# EAGLE design sulamatikV3 (EAGLE 6.4)
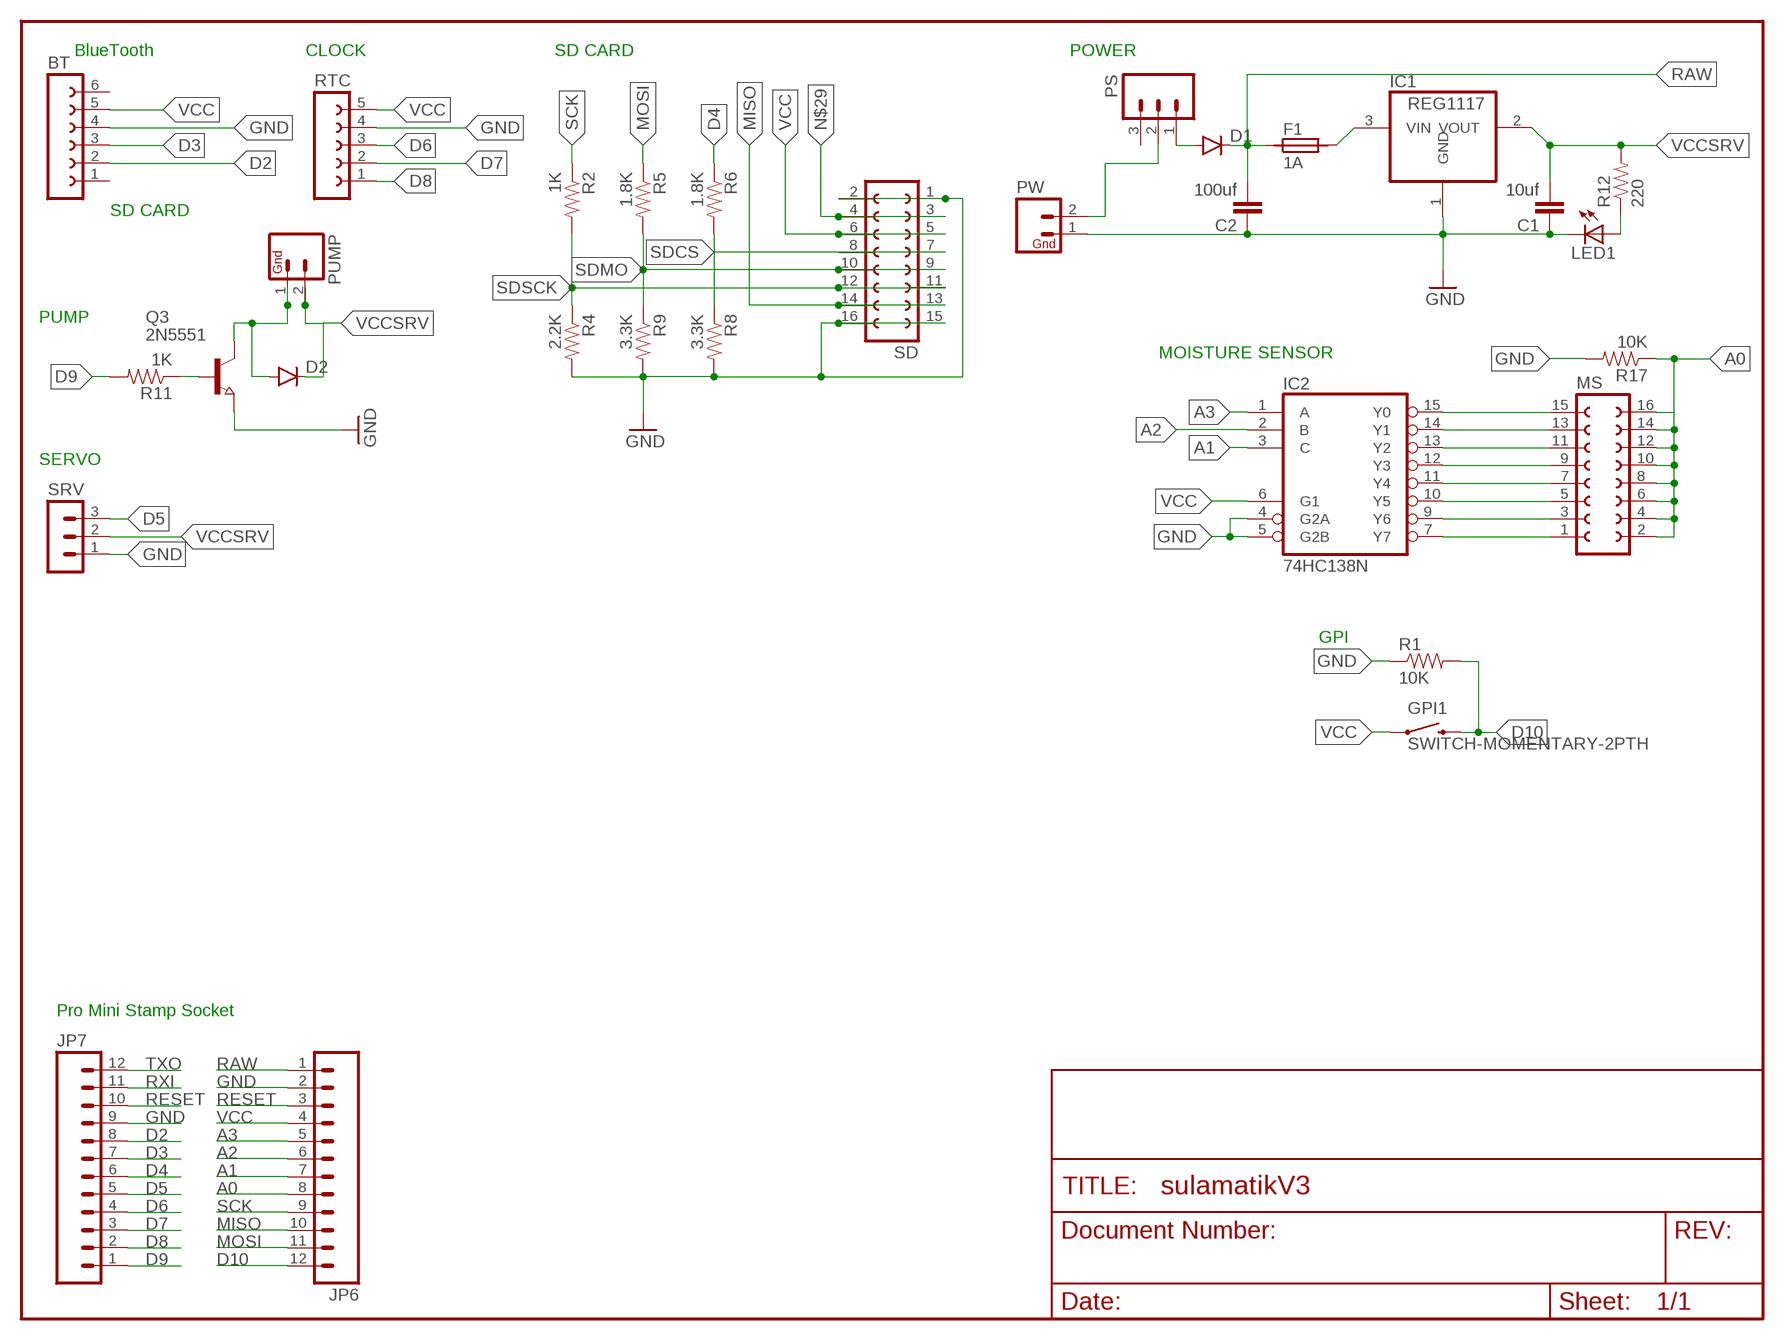
[diagram p0: schematic, sheet 1]

## Parts
BT  FE06-1  [FE06]
C1  10uf  CAP0805  [0805]
C2  100uf  CAP0805  [0805]
D1  DIODESMA  [SMA-DIODE]
D2  DIODESMA  [SMA-DIODE]
F1  1A  SIBA194600  [1820]
GPI1  SWITCH-MOMENTARY-2PTH  [TACTILE-PTH]
IC1  REG1117  [SOT223]
IC2  74HC138N  [DIL16]
JP6  M12PTH  [1X12]
JP7  M12PTH  [1X12]
LED1  LEDCHIP-LED0805  [CHIP-LED0805]
MS  FE08-2  [FE08-2]
PS  M03PTH  [1X03]
PUMP  M02PTH  [1X02]
PW  M02PTH  [1X02]
Q3  2N5551  NPN-TRANSISTOR_SOT23  [SOT23]
R1  10K  RESISTOR0805-RES  [0805]
R2  1K  RESISTOR0805-RES  [0805]
R4  2.2K  RESISTOR0805-RES  [0805]
R5  1.8K  RESISTOR0805-RES  [0805]
R6  1.8K  RESISTOR0805-RES  [0805]
R8  3.3K  RESISTOR0805-RES  [0805]
R9  3.3K  RESISTOR0805-RES  [0805]
R11  1K  RESISTOR0805-RES  [0805]
R12  220  RESISTOR0805-RES  [0805]
R17  10K  RESISTOR0805-RES  [0805]
RTC  FE05-1  [FE05-1]
SD  FE08-2  [FE08-2]
SRV  MA03-1  [MA03-1]

## Nets
A0: JP6.8 MS.2 MS.4 MS.6 MS.8 MS.10 MS.12 MS.14 MS.16 R17.1
A1: IC2.3(C) JP6.7
A2: IC2.2(B) JP6.6
A3: IC2.1(A) JP6.5
D2: BT.2 JP7.8
D3: BT.3 JP7.7
D4: JP7.6 R6.1
D5: JP7.5 SRV.3
D6: JP7.4 RTC.3
D7: JP7.3 RTC.2
D8: JP7.2 RTC.1
D9: JP7.1 R11.2
D10: GPI1.3 JP6.12 R1.2
GND: BT.4 C1.1 C2.1 IC1.1(GND) IC2.4(G2A) IC2.5(G2B) JP6.2 JP7.9 LED1.C PW.1 Q3.2(E) R1.1 R4.2 R8.2 R9.2 R17.2 RTC.4 SD.1 SD.2 SD.15 SD.16 SRV.1
MISO: JP6.10 SD.13 SD.14
MOSI: JP6.11 R5.1
N$1: F1.2 IC1.3(VIN)
N$2: PS.2 PW.2
N$3: IC2.15(Y0) MS.15
N$5: D2.A PUMP.1 Q3.3(C)
N$6: Q3.1(B) R11.1
N$7: IC2.14(Y1) MS.13
N$8: IC2.13(Y2) MS.11
N$10: IC2.12(Y3) MS.9
N$11: LED1.A R12.1
N$12: IC2.11(Y4) MS.7
N$13: D1.A PS.1
N$14: IC2.10(Y5) MS.5
N$15: IC2.9(Y6) MS.3
N$16: IC2.7(Y7) MS.1
N$29: SD.3 SD.4
RAW [v]: C2.2 D1.C F1.1 JP6.1
RESET: JP6.3 JP7.10
RXI: JP7.11
SCK: JP6.9 R2.1
SDCS: R6.2 R8.1 SD.7 SD.8
SDMO: R5.2 R9.1 SD.9 SD.10
SDSCK: R2.2 R4.1 SD.11 SD.12
TXO: JP7.12
VCC: BT.5 GPI1.1 IC2.6(G1) JP6.4 RTC.5 SD.5 SD.6
VCCSRV: C1.2 D2.C IC1.2(VOUT) PUMP.2 R12.2 SRV.2
Unconnected: BT.1 BT.6 PS.3

## Notes on the sheet
- BlueTooth | CLOCK | SD CARD | POWER
- SD CARD
- PUMP
- MOISTURE SENSOR
- SERVO
- GPI
- Pro Mini Stamp Socket

## Power pins joined to a net without a drawn wire
GND: IC2.8(GND)
VCC: IC2.16(VCC)

## Library data of the parts
BT = con-lsta:FE06-1: FEMALE HEADER; OC_FARNELL: unknown; OC_NEWARK: unknown
C1 C2 = SparkFun-Capacitors:CAP: Capacitor Standard 0603 ceramic capacitor, and 0.1" leaded capacitor.
D1 D2 = SparkFun-DiscreteSemi:DIODE: Diode These are standard reverse protection diodes and small signal diodes. SMA package can handle up to about 1A. SOD-323 can handle about 200mA. What the SOD-323 package when ordering, there are some mfgs out there that are 5-pin packages.
F1 = _hhn_PtcFuses_Siba_r500_Ozan:SIBA194600*: SIBA PTC-Fuses, Series 194600, 1812 (4.5 3.2)mm Source: www.siba.de/ Package: SMD 1812 (4.5 x 3.2)mm Technologies: SIBA194600Axxx xxx: Trip-Current * 10 mA Author: Dipl.-Ing. FH Rainer Bayer
GPI1 = SparkFun-Electromechanical:SWITCH-MOMENTARY-2: Various NO switches- pushbuttons, reed, etc
IC1 = burr-brown:REG1117: 800mA and 1A Low Dropout (LDO) Positive Regulator 1.8V, 2.5V, 2.85V, 3.3V, 5V, and Adj; MPN: REG1117; OC_FARNELL: 1097566; OC_NEWARK: 14P6981
IC2 = 74xx-eu:74*138: 3-line to 8-line DECODER/DEMULTIPLEXER
JP6 JP7 = SparkFun:M12: Header 12 Standard 12-pin 0.1" header. Use with straight break away headers (SKU : PRT-00116), right angle break away headers (PRT-00553), swiss pins (PRT-00743), machine pins (PRT-00117), and female headers (PRT-00115).
LED1 = led:LED: LED OSRAM: - CHIPLED LG R971, LG N971, LY N971, LG Q971, LY Q971, LO R971, LY R971 LH N974, LH R974 LS Q976, LO Q976, LY Q976 LO Q996 - Hyper CHIPLED LW Q18S LB Q993, LB Q99A, LB R99A - SideLED LS A670, LO A670, LY A670, LG A670, LP A670 LB A673, LV A673, LT A673, LW A673 LH A674 LY A675 LS A676, LA A676, LO A676, LY A676, LW A676 LS A679, LY A679, LG A679 - Hyper Micro SIDELED® LS Y876, LA Y876, LO Y876, LY Y876 LT Y87S - SmartLED LW L88C, LW L88S LB L89C, LB L89S, LG L890 LS L89K, LO L89K, LY L89K LS L896, LA L896, LO L896, LY L896 - TOPLED LS T670, LO T670, LY T670, LG T670, LP T670 LSG T670, LSP T670, LSY T670, LOP T670, LYG T670 LG T671, LOG T671, LSG T671 LB T673, LV T673, LT T673, LW T673 LH T674 LS T676, LA T676, LO T676, LY T676, LB T676, LH T676, LSB T676, LW T676 LB T67C, LV T67C, LT T67C, LS T67K, LO T67K, LY T67K, LW E67C LS E67B, LA E67B, LO E67B, LY E67B, LB E67C, LV E67C, LT E67C LW T67C LS T679, LY T679, LG T679 LS T770, LO T770, LY T770, LG T770, LP T770 LB T773, LV T773, LT T773, LW T773 LH T774 LS E675, LA E675, LY E675, LS T675 LS T776, LA T776, LO T776, LY T776, LB T776 LHGB T686 LT T68C, LB T68C - Hyper Mini TOPLED® LB M676 - Mini TOPLED Santana® LG M470 LS M47K, LO M47K, LY M47K Source: http://www.osram.convergy.de LUXEON: - LUMILED® LXK2-PW12-R00, LXK2-PW12-S00, LXK2-PW14-U00, LXK2-PW14-V00 LXK2-PM12-R00, LXK2-PM12-S00, LXK2-PM14-U00 LXK2-PE12-Q00, LXK2-PE12-R00, LXK2-PE12-S00, LXK2-PE14-T00, LXK2-PE14-U00 LXK2-PB12-K00, LXK2-PB12-L00, LXK2-PB12-M00, LXK2-PB14-N00, LXK2-PB14-P00, LXK2-PB14-Q00 LXK2-PR12-L00, LXK2-PR12-M00, LXK2-PR14-Q00, LXK2-PR14-R00 LXK2-PD12-Q00, LXK2-PD12-R00, LXK2-PD12-S00 LXK2-PH12-R00, LXK2-PH12-S00 LXK2-PL12-P00, LXK2-PL12-Q00, LXK2-PL12-R00 Source: www.luxeon.com KINGBRIGHT: KA-3528ASYC Source: www.kingbright.com
MS SD = con-lsta:FE08-2: FEMALE HEADER; OC_FARNELL: unknown; OC_NEWARK: unknown
PS = SparkFun-Connectors:M03: Header 3 Standard 3-pin 0.1" header. Use with straight break away headers (SKU : PRT-00116), right angle break away headers (PRT-00553), swiss pins (PRT-00743), machine pins (PRT-00117), and female headers (PRT-00115). Molex polarized connector foot print use with SKU : PRT-08232 with associated crimp pins and housings.
PUMP PW = SparkFun:M02: Header 2 Standard 2-pin 0.1" header. Use with straight break away headers (SKU : PRT-00116), right angle break away headers (PRT-00553), swiss pins (PRT-00743), machine pins (PRT-00117), and female headers (PRT-00115). Molex polarized connector foot print use with SKU : PRT-08233 with associated crimp pins and housings.
Q3 = semicon-smd-ipc:NPN-TRANSISTOR_: NPN TRANSISTOR
R1 R2 R4-R6 R8 R9 R11 R12 R17 = SparkFun-Passives:RESISTOR: Resistor Basic schematic elements and footprints for 0603, 1206, and PTH resistors.
RTC = con-lsta:FE05-1: FEMALE HEADER; OC_FARNELL: unknown; OC_NEWARK: unknown
SRV = con-lstb:MA03-1: PIN HEADER; OC_FARNELL: unknown; OC_NEWARK: unknown

## Net classes
0 default: width 0.3 mm, drill 0.5 mm, clearance 0.25 mm

## Board
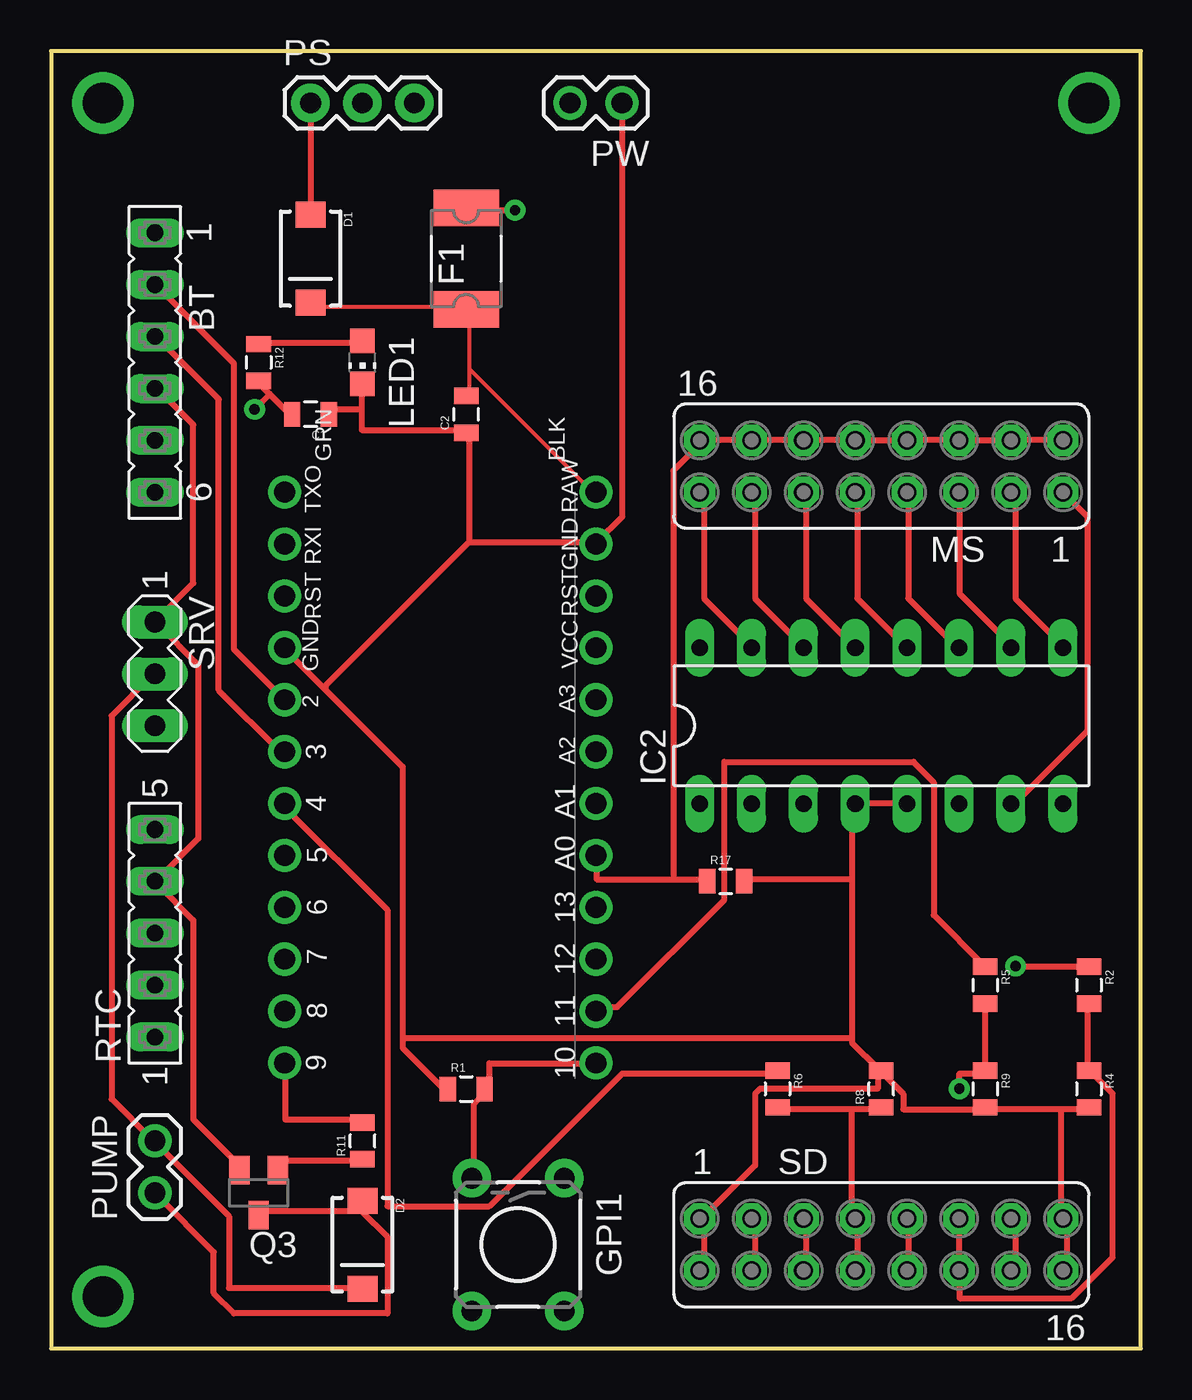
[diagram p1: board, top side]
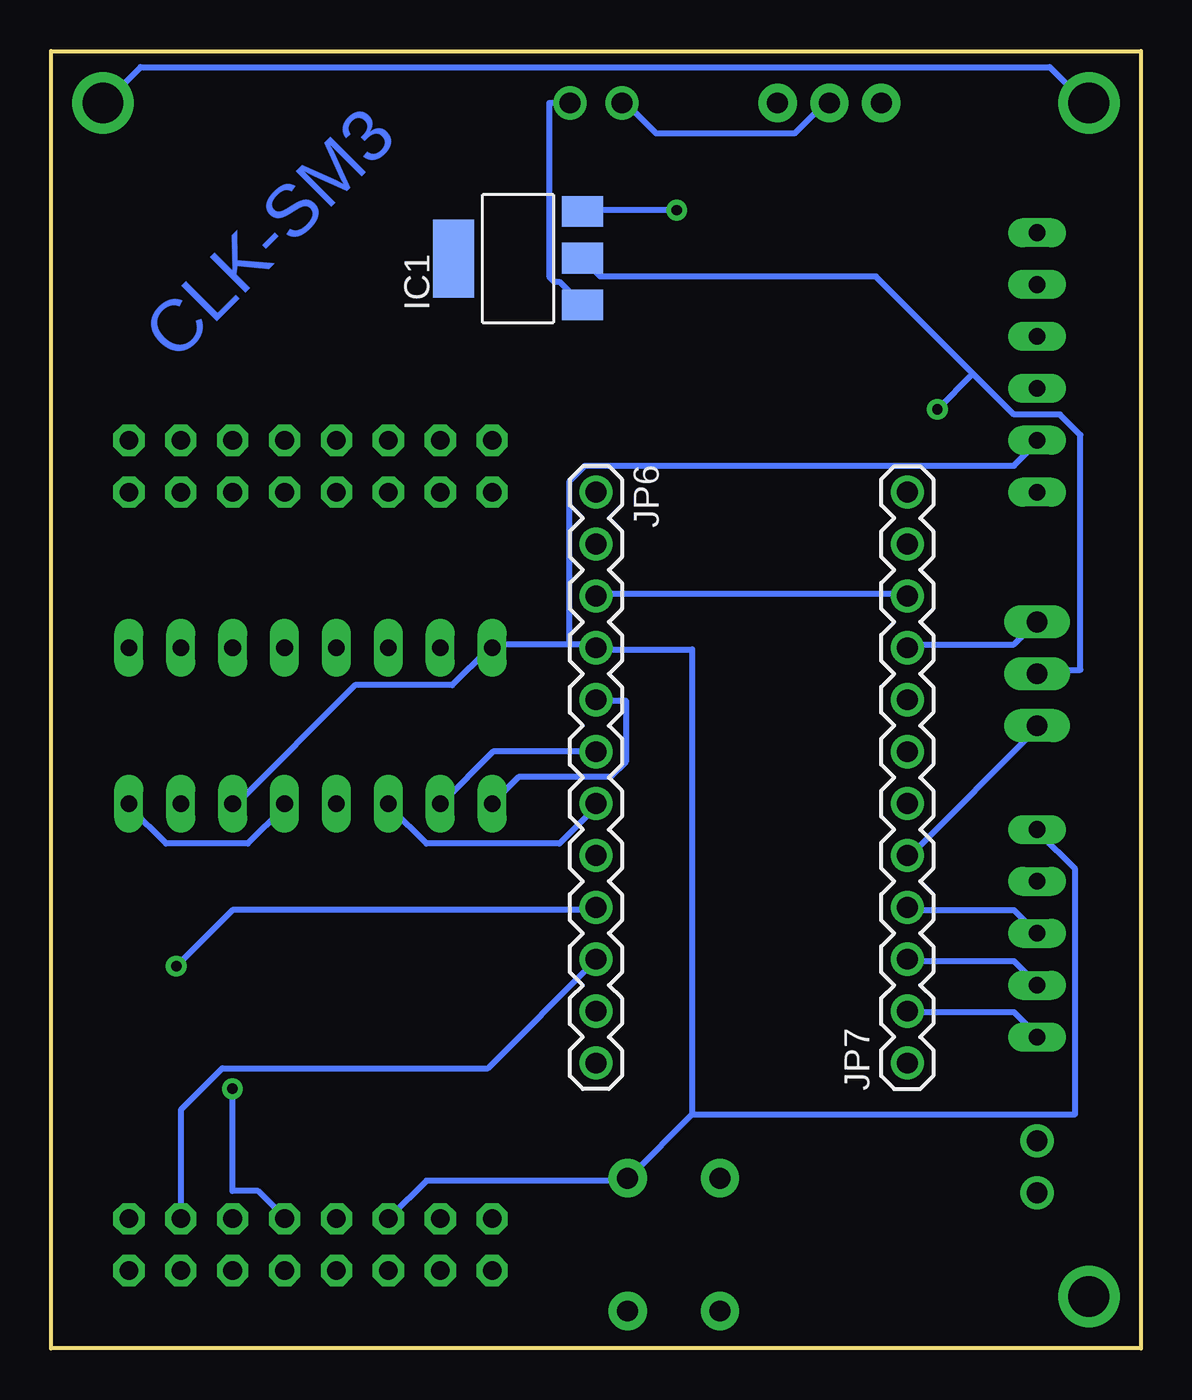
[diagram p2: board, bottom side, seen from below]

Size 53.34 x 63.5 mm. Coordinates in mm from the lower left corner, seen from the top.
Outline: 0,63.5 0,0 53.34,0 53.34,63.5 0,63.5
Copper layers (1*16): Top 0.035mm / dielectric 1.5mm / Bottom 0.035mm
Design rules "SparkFun *": minimum track width 8mil, minimum drill 20mil, track to track 8mil, track to pad 8mil, pad to pad 8mil, via to via 8mil, smd to smd 8mil, copper to edge 10mil, drill to drill 8mil, minimum pad ring 12mil, minimum via ring 10mil, stop-mask expansion 4mil, vias tented up to drill 20mil, thermal gap 10mil

### Footprints (pad centres in the part's own frame; a part is rotated, then mirrored left to right if it is on the bottom)
FE06 = drill 0.813 long: 1 -6.35,0; 2 -3.81,0; 3 -1.27,0; 4 1.27,0; 5 3.81,0; 6 6.35,0
0805 = smd 0.8 x 1.2: 1 -0.9,0; 2 0.9,0
SMA-DIODE = smd 1.27 x 1.47: A -2.15,0; C 2.15,0
1820 = smd 1.78 x 3.2: 1 -2.49,0; 2 2.49,0
TACTILE-PTH = drill 1.016 pad 1.88: 1 -3.251,2.261; 2 3.251,2.261; 3 -3.251,-2.261; 4 3.251,-2.261
SOT223 = smd 1.499 x 2.007: 1 -2.261,-3.15; 2 0.025,-3.15; 3 2.311,-3.15 | smd 3.81 x 2.007: 4 0,3.15
DIL16 = drill 0.813 long: 1 -8.89,-3.81; 2 -6.35,-3.81; 3 -3.81,-3.81; 4 -1.27,-3.81; 5 1.27,-3.81; 6 3.81,-3.81; 7 6.35,-3.81; 8 8.89,-3.81; 9 8.89,3.81; 10 6.35,3.81; 11 3.81,3.81; 12 1.27,3.81; 13 -1.27,3.81; 14 -3.81,3.81; 15 -6.35,3.81; 16 -8.89,3.81
1X12 = drill 1.016: 1 0,0; 2 2.54,0; 3 5.08,0; 4 7.62,0; 5 10.16,0; 6 12.7,0; 7 15.24,0; 8 17.78,0; 9 20.32,0; 10 22.86,0; 11 25.4,0; 12 27.94,0
CHIP-LED0805 = smd 1.2 x 1.2: A 0,-1.05; C 0,1.05
FE08-2 = drill 0.914 octagon: 1 -8.89,1.27; 2 -8.89,-1.27; 3 -6.35,1.27; 4 -6.35,-1.27; 5 -3.81,1.27; 6 -3.81,-1.27; 7 -1.27,1.27; 8 -1.27,-1.27; 9 1.27,1.27; 10 1.27,-1.27; 11 3.81,1.27; 12 3.81,-1.27; 13 6.35,1.27; 14 6.35,-1.27; 15 8.89,1.27; 16 8.89,-1.27
1X03 = drill 1.016 pad 1.88: 1 0,0; 2 2.54,0; 3 5.08,0
1X02 = drill 1.016: 1 0,0; 2 2.54,0
SOT23 = smd 1 x 1.4: 1 -0.95,-1.1; 2 0.95,-1.1; 3 0,1.1
FE05-1 = drill 0.813 long: 1 -5.08,0; 2 -2.54,0; 3 0,0; 4 2.54,0; 5 5.08,0
MA03-1 = drill 1.016 long: 1 -2.54,0; 2 0,0; 3 2.54,0

### Placement (x,y rotation side)
BT  5.08,48.26 270 top
C1  12.7,45.72 180 top
C2  20.32,45.72 90 top
D1  12.7,53.34 270 top
D2  15.24,5.08 270 top
F1  20.32,53.34 90 top
GPI1  22.86,5.08 270 top
IC1  30.48,53.34 90 bottom
IC2  40.64,30.48 0 top
JP6  26.67,41.91 270 bottom
JP7  11.43,13.97 90 bottom
LED1  15.24,48.26 180 top
MS  40.64,43.18 180 top
PS  12.7,60.96 0 top
PUMP  5.08,7.62 90 top
PW  27.94,60.96 180 top
Q3  10.16,7.62 180 top
R1  20.32,12.7 0 top
R2  50.8,17.78 270 top
R4  50.8,12.7 270 top
R5  45.72,17.78 270 top
R6  35.56,12.7 270 top
R8  40.64,12.7 90 top
R9  45.72,12.7 270 top
R11  15.24,10.16 90 top
R12  10.16,48.26 270 top
R17  33.02,22.86 0 top
RTC  5.08,20.32 90 top
SD  40.64,5.08 0 top
SRV  5.08,33.02 270 top

### Tracks (layer width: path | path; a pad name or v marks a point on that pad's centre or on a via)
A0
  Top 0.3: 30.46,22.96 26.71,22.96 26.71,23.96 JP6.8 | 30.46,22.96 31.96,22.96 R17.1 | MS.2 49.46,44.46 47.21,44.46 MS.4 46.96,44.46 MS.6 44.21,44.46 41.96,44.46 MS.8 41.71,44.46 39.46,44.46 MS.10 39.21,44.46 36.96,44.46 MS.12 36.71,44.46 34.46,44.46 MS.14 34.21,44.46 31.96,44.46 MS.16 31.71,44.21 30.46,42.96 30.46,22.96
A1
  Bottom 0.3: IC2.3 36.71,26.46 34.96,24.71 28.46,24.71 26.71,26.46 JP6.7
A2
  Bottom 0.3: JP6.6 31.71,29.21 34.21,26.71 IC2.2
A3
  Bottom 0.3: IC2.1 30.46,27.96 25.96,27.96 25.21,28.71 25.21,31.71 26.46,31.71 JP6.5
D2
  Top 0.3: BT.2 5.21,51.96 8.96,48.21 8.96,34.21 11.21,31.96 JP7.8
D3
  Top 0.3: BT.3 5.21,49.46 8.21,46.46 8.21,32.21 11.21,29.21 JP7.7
D4
  Top 0.3: R6.1 35.46,13.46 27.96,13.46 21.46,6.96 16.46,6.96 16.46,21.46 11.46,26.46 JP7.6
D5
  Bottom 0.3: JP7.5 11.21,24.21 4.96,30.46 SRV.3
D6
  Bottom 0.3: RTC.3 5.21,20.46 6.21,21.46 11.21,21.46 JP7.4
D7
  Bottom 0.3: RTC.2 5.21,17.96 6.21,18.96 11.21,18.96 JP7.3
D8
  Bottom 0.3: RTC.1 5.21,15.46 6.21,16.46 11.21,16.46 JP7.2
D9
  Top 0.3: R11.2 15.21,11.21 11.46,11.21 11.46,13.96 JP7.1
D10
  Top 0.3: GPI1.3 20.71,8.46 20.71,11.96 21.21,12.46 R1.2 21.46,12.71 21.46,13.96 26.46,13.96 JP6.12
GND
  Top 0.3: 49.46,11.71 50.71,11.71 R4.2 | 49.46,11.71 45.96,11.71 R9.2 45.71,11.71 41.71,11.71 41.71,12.46 40.71,13.46 R8.2 | 49.46,11.71 49.46,6.46 SD.15 49.71,6.21 49.71,3.96 SD.16 | SD.2 31.96,3.96 31.96,6.21 SD.1 31.96,6.46 34.46,8.96 34.46,12.46 34.71,12.71 40.46,12.71 40.46,13.46 R8.2 | 39.21,22.96 33.96,22.96 R17.2 | 39.21,22.96 39.21,26.46 IC2.4 39.46,26.71 41.71,26.71 IC2.5 | 39.21,22.96 39.21,15.21 | 39.21,15.21 39.21,14.96 40.46,13.71 R8.2 | 15.21,45.96 13.71,45.96 C1.1 | 15.21,45.96 15.21,47.21 LED1.C | 15.21,45.96 15.21,44.96 20.21,44.96 C2.1 20.46,44.71 20.46,39.46 | 20.46,39.46 26.46,39.46 JP6.2 26.71,39.46 27.96,40.71 27.96,60.96 PW.1 | Q3.2 9.21,8.96 6.96,11.21 6.96,20.96 5.21,22.71 RTC.4 5.21,22.96 7.21,24.96 7.21,33.46 5.21,35.46 SRV.1 5.21,35.71 6.96,37.46 6.96,45.21 5.21,46.96 BT.4 | 17.21,15.21 17.21,28.46 13.46,32.21 | 17.21,15.21 17.21,14.71 19.21,12.71 R1.1 | 13.46,32.21 11.46,34.21 JP7.9 | 20.46,39.46 13.46,32.46 13.46,32.21 | 17.21,15.21 39.21,15.21
  Bottom 0.3: IC2.8 49.46,26.46 47.71,24.71 43.71,24.71 41.96,26.46 IC2.5 | PW.1 28.96,60.96 28.96,52.46 28.71,52.21 28.46,52.21 27.46,51.21 IC1.1 | SRV.1 5.21,35.46 6.21,34.46 11.21,34.46 JP7.9
MISO
  Top 0.3: SD.14 47.21,3.96 47.21,6.21 SD.13
  Bottom 0.3: JP6.10 26.71,18.96 31.96,13.71 44.96,13.71 46.96,11.71 46.96,6.46 SD.13
MOSI
  Top 0.3: R5.1 45.71,18.71 43.21,21.21 43.21,27.71 42.21,28.71 32.96,28.71 32.96,21.96 27.71,16.71 26.71,16.71 JP6.11
N$1  (via drill 0.51)
  Top 0.3: v22.71,55.71 20.46,55.71 F1.2
  Bottom 0.3: v22.71,55.71 27.21,55.71 IC1.3
N$2
  Bottom 0.3: PW.2 25.21,60.96 23.71,59.46 16.96,59.46 15.46,60.96 PS.2
N$3
  Top 0.3: IC2.15 34.21,34.46 31.96,36.71 31.96,41.71 MS.15
N$4  (via drill 2)
  other vias: 2.54,2.54
N$5
  Top 0.3: 15.21,6.71 10.21,6.71 Q3.3 | 15.21,6.71 15.21,7.21 D2.A 15.21,6.71 | 15.21,6.71 16.46,5.46 16.46,1.71 8.96,1.71 7.96,2.71 7.96,4.71 5.21,7.46 PUMP.1
N$6
  Top 0.3: R11.1 15.21,9.21 11.21,9.21 11.21,8.96 Q3.1
N$7
  Top 0.3: IC2.14 36.71,34.46 34.46,36.71 34.46,41.71 MS.13
N$8
  Top 0.3: IC2.13 39.21,34.46 36.96,36.71 36.96,41.71 MS.11
N$9  (via drill 2)
  Bottom 0.3: v2.54,60.96 2.71,60.96 4.46,62.71 48.96,62.71 50.71,60.96 v50.8,60.96
N$10
  Top 0.3: IC2.12 41.71,34.46 39.46,36.71 39.46,41.71 MS.9
N$11
  Top 0.3: R12.1 10.21,49.21 15.21,49.21 LED1.A
N$12
  Top 0.3: IC2.11 44.21,34.46 41.96,36.71 41.96,41.71 MS.7
N$13
  Top 0.3: D1.A 12.71,55.71 PS.1
N$14
  Top 0.3: IC2.10 46.96,34.46 44.46,36.96 44.46,41.71 MS.5
N$15
  Top 0.3: IC2.9 49.46,34.46 47.21,36.71 47.21,41.71 MS.3
N$16
  Top 0.3: IC2.7 47.21,26.71 50.71,30.21 50.71,40.71 49.71,41.71 MS.1
N$29
  Top 0.3: SD.4 34.46,3.96 34.46,6.21 SD.3
RAW
  Top 0.203: 20.46,47.96 20.46,50.71 F1.1 20.21,50.96 12.71,50.96 D1.C | 20.46,47.96 20.46,46.71 C2.2 | 20.46,47.96 26.46,41.96 JP6.1
RESET
  Bottom 0.3: JP7.10 11.46,36.96 26.46,36.96 JP6.3
SCK  (via drill 0.51)
  Top 0.3: v47.21,18.71 50.71,18.71 R2.1
  Bottom 0.3: v47.21,18.71 44.46,21.46 26.71,21.46 JP6.9
SDCS
  Top 0.3: 39.21,11.71 40.46,11.71 R8.1 | 39.21,11.71 35.71,11.71 R6.2 | 39.21,11.71 39.21,6.46 SD.7 39.46,6.21 39.46,3.96 SD.8
SDMO  (via drill 0.51)
  Top 0.3: R5.2 45.71,16.71 45.71,13.71 R9.1 45.71,13.46 44.46,13.46 v44.46,12.71 | SD.10 41.96,3.96 41.96,6.21 SD.9
  Bottom 0.3: v44.46,12.71 44.46,7.71 43.21,7.71 41.96,6.46 SD.9
SDSCK
  Top 0.3: R2.2 50.71,16.71 50.71,13.71 R4.1 50.96,13.46 51.96,12.46 51.96,4.46 49.96,2.46 44.46,2.46 44.46,3.71 SD.12 44.46,3.96 44.46,6.21 SD.11
VCC
  Top 0.3: SD.6 36.96,3.96 36.96,6.21 SD.5
  Bottom 0.3: 21.96,11.46 3.21,11.46 3.21,23.46 4.96,25.21 RTC.5 | 21.96,11.46 24.96,8.46 GPI1.1 25.21,8.21 34.96,8.21 36.71,6.46 SD.5 | 27.96,34.46 26.71,34.46 JP6.4 26.46,34.21 21.96,34.21 21.96,11.46 | 27.96,34.46 31.71,34.46 IC2.16 31.96,34.21 33.71,32.46 38.46,32.46 44.21,26.71 IC2.6 | 27.96,34.46 27.96,42.46 27.21,43.21 6.21,43.21 5.21,44.21 BT.5
VCCSRV  (via drill 0.51)
  Top 0.3: D2.C 15.21,2.96 8.71,2.96 8.71,6.46 5.21,9.96 PUMP.2 4.96,10.21 2.96,12.21 2.96,30.96 4.96,32.96 SRV.2 | 10.71,46.71 11.71,45.71 C1.2 | 10.71,46.71 10.21,47.21 R12.2 | v9.96,45.96 10.71,46.71
  Bottom 0.3: 8.21,47.71 6.21,45.71 3.96,45.71 2.96,44.71 2.96,33.21 4.96,33.21 SRV.2 | 8.21,47.71 12.96,52.46 26.46,52.46 27.21,53.21 IC1.2 | 8.21,47.71 v9.96,45.96

### Text on the board
Bottom: CLK-SM3
tPlace: GRN | BLK | TXO | RAW | RXI | GND | RST | RST | GND | VCC | 2 | A3 | 3 | A2 | 4 | A1 | 5 | A0 | 6 | 13 | 7 | 12 | 8 | 11 | 9 | 10